# EAGLE schematic Arduino_mount (EAGLE 9.1.2)
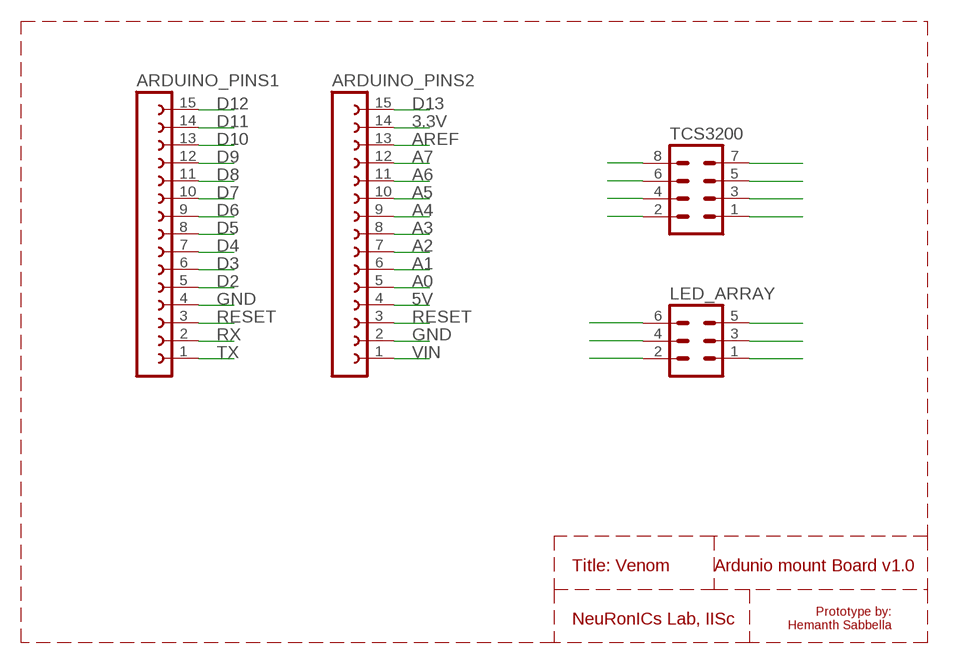
[diagram p0: schematic, sheet 1]

## Parts
ARDUINO_PINS1  FE15-1  [FE15]
ARDUINO_PINS2  FE15-1  [FE15]
LED_ARRAY  MA03-2  [MA03-2]
TCS3200  MA04-2  [MA04-2]

## Nets
3.3V: ARDUINO_PINS2.14
5V: ARDUINO_PINS2.4
A0: ARDUINO_PINS2.5
A1: ARDUINO_PINS2.6
A2: ARDUINO_PINS2.7
A3: ARDUINO_PINS2.8
A4: ARDUINO_PINS2.9
A5: ARDUINO_PINS2.10
A6: ARDUINO_PINS2.11
A7: ARDUINO_PINS2.12
AREF: ARDUINO_PINS2.13
D2: ARDUINO_PINS1.5
D3: ARDUINO_PINS1.6
D4: ARDUINO_PINS1.7
D5: ARDUINO_PINS1.8
D6: ARDUINO_PINS1.9
D7: ARDUINO_PINS1.10
D8: ARDUINO_PINS1.11
D9: ARDUINO_PINS1.12
D10: ARDUINO_PINS1.13
D11: ARDUINO_PINS1.14
D12: ARDUINO_PINS1.15
D13: ARDUINO_PINS2.15
GND: ARDUINO_PINS1.4 ARDUINO_PINS2.2
N$1: TCS3200.2
N$2: TCS3200.1
N$3: TCS3200.4
N$4: TCS3200.3
N$5: TCS3200.5
N$6: TCS3200.6
N$7: TCS3200.8
N$8: TCS3200.7
N$9: LED_ARRAY.2
N$10: LED_ARRAY.4
N$11: LED_ARRAY.6
N$12: LED_ARRAY.5
N$13: LED_ARRAY.3
N$14: LED_ARRAY.1
RESET: ARDUINO_PINS1.3 ARDUINO_PINS2.3
RX: ARDUINO_PINS1.2
TX: ARDUINO_PINS1.1
VIN: ARDUINO_PINS2.1

## Notes on the sheet
- Title: Venom | Ardunio mount Board v1.0
- Prototype by:
  Hemanth Sabbella
- NeuRonICs Lab, IISc

## Library data of the parts
ARDUINO_PINS1 ARDUINO_PINS2 = con-lsta:FE15-1: FEMALE HEADER; OC_FARNELL: unknown; OC_NEWARK: unknown
LED_ARRAY = con-lstb:MA03-2: PIN HEADER; OC_FARNELL: unknown; OC_NEWARK: unknown
TCS3200 = con-lstb:MA04-2: PIN HEADER; OC_FARNELL: unknown; OC_NEWARK: unknown